# EAGLE schematic juawms_0-2 (EAGLE 9.2.0)
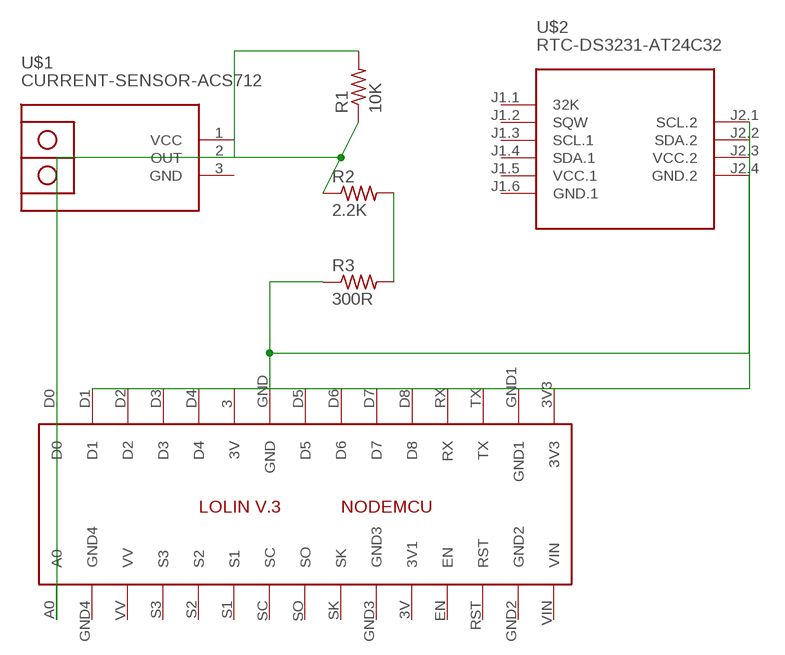
[diagram p0: schematic, sheet 1]

## Parts
IC1  LOLINV3  [LOLINV3]
R1  10K  R-US_0207/10  [0207/10]
R2  2.2K  R-US_0207/10  [0207/10]
R3  300R  R-US_0207/10  [0207/10]
U$1  CURRENT-SENSOR-ACS712  [CURRENT-SENSOR-ACS712]
U$2  RTC-DS3231-AT24C32  [RTC-DS3231-AT24C32]

## Nets
N$1: IC1.GND R3.1 U$2.J2.4(GND.2)
N$2: R2.2 R3.2
N$3: IC1.A0 R1.1 R2.1
N$4: R1.2 U$1.2(OUT)
N$5: IC1.D2 U$2.J2.2(SDA.2)
N$6: IC1.D1 U$2.J2.1(SCL.2)
Unconnected: IC1.3(3V) IC1.3V3 IC1.3V(3V1) IC1.D0 IC1.D3 IC1.D4 IC1.D5 IC1.D6 IC1.D7 IC1.D8 IC1.EN IC1.GND1 IC1.GND2 IC1.GND3 IC1.GND4 IC1.RST IC1.RX IC1.S1 IC1.S2 IC1.S3 IC1.SC IC1.SK IC1.SO IC1.TX IC1.VIN IC1.VV U$2.J1.1(32K) U$2.J1.2(SQW) U$2.J1.3(SCL.1) U$2.J1.4(SDA.1)

## Power pins joined to a net without a drawn wire
GND: U$1.3(GND)
GND.1: U$2.J1.6(GND.1)
VCC: U$1.1(VCC)
VCC.1: U$2.J1.5(VCC.1)
VCC.2: U$2.J2.3(VCC.2)

## Library data of the parts
IC1 = Lolin:LOLINV3
R1-R3 = rcl:R-US_: RESISTOR, American symbol; SPICEPREFIX: R
U$1 = diy-modules:CURRENT-SENSOR-ACS712: Isolated Bipolar Current Sensors based on ACS712 chip More details available here: http://embedded-lab.com/blog/a-brief-overview-of-allegro-acs712-current-sensor-part-1/ Click here to find device on ebay.com <http://www.ebay.com/sch/acs712+module> Note: There are many available versions with different pinout. Please check before use
U$2 = diy-modules:RTC-DS3231-AT24C32: RTC Module with Battery and EEPROM based on DS3231 and AT24C32 chips Tutorial can be found here: https://edwardmallon.wordpress.com/2014/05/21/using-a-cheap-3-ds3231-rtc-at24c32-eeprom-from-ebay/ Click here to find device on ebay.com <http://www.ebay.com/sch/DS3231+AT24C32+module>